# Altium schematic sheet SH5 - MICROCONTROLLER.SchDoc: MCU
size Letter; DrawnBy: Qinyang Bao, Nicole Rosario; Organization: UW Robotics; Address1: 200 University Avenue; Address2: Waterloo; Address3: Ontario; Address4: Canada N2L 3G6
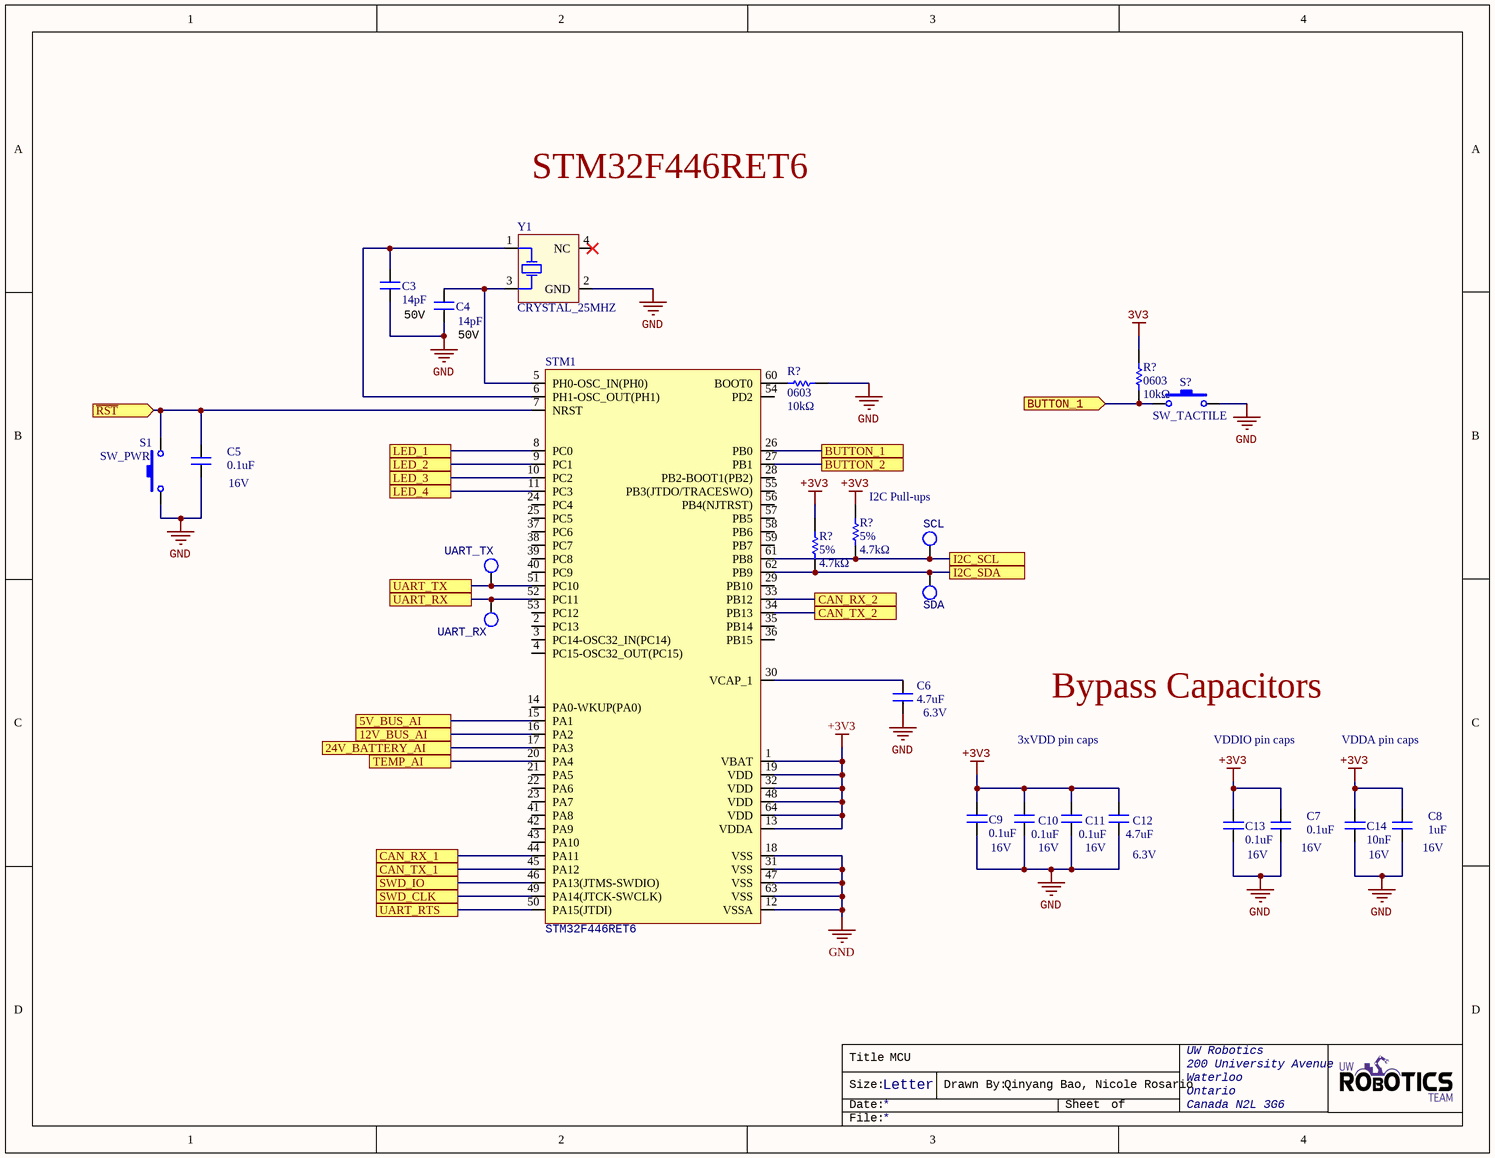
[diagram p0: SH5 - MICROCONTROLLER.SchDoc]

## Parts
(Parts that share a designator on the sheet are numbered #1, #2 ... from top to bottom, then left to right.)
C3  value 14pF  Voltage Rating: 50V  [CAPC0603(1608)55_N]  (hidden comment: CL10C140JB8NNNC)
C4  value 14pF  Voltage Rating: 50V  [CAPC0603(1608)55_N]  (hidden comment: CL10C140JB8NNNC)
C5  value 0.1uF  Voltage Rating: 16V  [CAPC0603(1608)55_N]  (hidden comment: CAP_0.1uF_16V_0603)
C6  value 4.7uF  Voltage Rating: 6.3V  [CAPC0603(1608)55_N]  (hidden comment: CAP_4.7uF_0603)
C7  value 0.1uF  Voltage Rating: 16V  [CAPC0603(1608)55_N]  (hidden comment: CAP_0.1uF_16V_0603)
C8  value 1uF  Voltage Rating: 16V  [CAPC0603(1608)55_N]  (hidden comment: CAP_1uF_16V_0603)
C9  value 0.1uF  Voltage Rating: 16V  [CAPC0603(1608)55_N]  (hidden comment: CAP_0.1uF_16V_0603)
C10  value 0.1uF  Voltage Rating: 16V  [CAPC0603(1608)55_N]  (hidden comment: CAP_0.1uF_16V_0603)
C11  value 0.1uF  Voltage Rating: 16V  [CAPC0603(1608)55_N]  (hidden comment: CAP_0.1uF_16V_0603)
C12  value 4.7uF  Voltage Rating: 6.3V  [CAPC0603(1608)55_N]  (hidden comment: CAP_4.7uF_0603)
C13  value 0.1uF  Voltage Rating: 16V  [CAPC0603(1608)55_N]  (hidden comment: CAP_0.1uF_16V_0603)
C14  value 10nF  Voltage Rating: 16V  [CAPC0603(1608)55_N]  (hidden comment: CAP_10nF_0603)
R?#1  value 10kΩ  Case Code (Imperial): 0603  [RESC0603(1608)_N]  (hidden comment: RES_10kΩ_0603)
R?#2  value 10kΩ  Case Code (Imperial): 0603  [RESC0603(1608)_N]  (hidden comment: RES_10kΩ_0603)
R?#3  value 4.7kΩ  Tolerance: 5%  [RESC0603(1608)_N]  (hidden comment: RES_4.7kΩ_0603)
R?#4  value 4.7kΩ  Tolerance: 5%  [RESC0603(1608)_N]  (hidden comment: RES_4.7kΩ_0603)
S1  SW_PWR  [PTS830GM140]
S?  SW_TACTILE  [B3U-1100P]
SCL  TESTPOINT_LOOP  [TESTPOINT_LOOP]  (value not drawn)
SDA  TESTPOINT_LOOP  [TESTPOINT_LOOP]  (value not drawn)
STM1  STM32F446RET6  [STM-LQFP64_L]
UART_RX  TESTPOINT_LOOP  [TESTPOINT_LOOP]  (value not drawn)
UART_TX  TESTPOINT_LOOP  [TESTPOINT_LOOP]  (value not drawn)
Y1  CRYSTAL_25MHZ  [AVX-CX2520DB32000D0GEJZ1-4_V]

## Ports
5V_BUS_AI, 12V_BUS_AI, 24V_BATTERY_AI, BUTTON_1, BUTTON_1 (in), BUTTON_2, CAN_RX_1, CAN_RX_2, CAN_TX_1, CAN_TX_2, I2C_SCL, I2C_SDA, LED_1, LED_2, LED_3, LED_4, SWD_CLK, SWD_IO, TEMP_AI, UART_RTS, UART_RX, UART_TX, ~{RST} (in)

## Nets
3V3: R?#1.2
+3V3: C7.2 C8.2 C9.2 C10.2 C11.2 C12.2 C13.2 C14.2 R?#3.2 R?#4.2 STM1.1(VBAT) STM1.13(VDDA) STM1.19(VDD) STM1.32(VDD) STM1.48(VDD) STM1.64(VDD)
GND: C3.1 C4.1 C5.1 C6.1 C7.1 C8.1 C9.1 C10.1 C11.1 C12.1 C13.1 C14.1 R?#2.2 S1.1 S?.2 STM1.12(VSSA) STM1.18(VSS) STM1.31(VSS) STM1.47(VSS) STM1.63(VSS) Y1.2(GND)
5V_BUS_AI: STM1.15(PA1) ; port 5V_BUS_AI
12V_BUS_AI: STM1.16(PA2) ; port 12V_BUS_AI
24V_BATTERY_AI: STM1.17(PA3) ; port 24V_BATTERY_AI
~{RST}: C5.2 S1.2 STM1.7(NRST) ; port ~{RST}
BUTTON_1: R?#1.1 S?.1 STM1.26(PB0) ; port BUTTON_1
BUTTON_2: STM1.27(PB1) ; port BUTTON_2
CAN_RX_1: STM1.44(PA11) ; port CAN_RX_1
CAN_RX_2: STM1.33(PB12) ; port CAN_RX_2
CAN_TX_1: STM1.45(PA12) ; port CAN_TX_1
CAN_TX_2: STM1.34(PB13) ; port CAN_TX_2
I2C_SCL: R?#3.1 SCL.1 STM1.61(PB8) ; port I2C_SCL
I2C_SDA: R?#4.1 SDA.1 STM1.62(PB9) ; port I2C_SDA
LED_1: STM1.8(PC0) ; port LED_1
LED_2: STM1.9(PC1) ; port LED_2
LED_3: STM1.10(PC2) ; port LED_3
LED_4: STM1.11(PC3) ; port LED_4
SWD_CLK: STM1.49(PA14(JTCK-SWCLK)) ; port SWD_CLK
SWD_IO: STM1.46(PA13(JTMS-SWDIO)) ; port SWD_IO
TEMP_AI: STM1.20(PA4) ; port TEMP_AI
UART_RTS: STM1.50(PA15(JTDI)) ; port UART_RTS
UART_RX: STM1.52(PC11) UART_RX.1 ; port UART_RX
UART_TX: STM1.51(PC10) UART_TX.1 ; port UART_TX
NetC3_2: C3.2 STM1.6(PH1-OSC_OUT(PH1)) Y1.1(HOT)
NetC4_2: C4.2 STM1.5(PH0-OSC_IN(PH0)) Y1.3(HOT)
NetC6_2: C6.2 STM1.30(VCAP_1)
NetR?#2_1: R?#2.1 STM1.60(BOOT0)

Not connected (* = marked no-connect by the designer): STM1 2(PC13) 3(PC14-OSC32_IN(PC14)) 4(PC15-OSC32_OUT(PC15)) 14(PA0-WKUP(PA0)) 21(PA5) 22(PA6) 23(PA7) 24(PC4) 25(PC5) 28(PB2-BOOT1(PB2)) 29(PB10) 35(PB14) 36(PB15) 37(PC6) 38(PC7) 39(PC8) 40(PC9) 41(PA8) 42(PA9) 43(PA10) 53(PC12) 54(PD2) 55(PB3(JTDO/TRACESWO)) 56(PB4(NJTRST)) 57(PB5) 58(PB6) 59(PB7); Y1 4(NC)*

## Notes on the sheet
- STM32F446RET6
- (near R?#3) I2C Pull-ups
- Bypass Capacitors
- 3xVDD pin caps
- VDDIO pin caps
- VDDA pin caps
- Title
- Size:
- Date:
- Letter
- Drawn By:
- Sheet
- of
- File:

## Library data of the parts
C3 C4 = CL10C140JB8NNNC: Cap Ceramic 14pF 50V C0G 5% SMD 0603 125C Cardboard T/R; Manufacturer 1: Samsung; Supplier Part Number 1: 1276-2187-1-ND; Supplier 1: Digi-Key; Manufacturer Part Number 1: CL10C140JB8NNNC; Stock 1: 187088; Pricing 1: 1=0.10000, 10=0.06700, 100=0.02980, 500=0.02130, 1000=0.01673 (USD); RoHS: Yes; Mount: Surface Mount; Case/Package: 0603; Case Code (Metric): 1608; Case Code (Imperial): 0603; Min Operating Temperature: -55°C; Max Operating Temperature: 125°C; Tolerance: 5%; Package Quantity: 1; Packaging: Tape and Reel; Voltage Rating (DC): 50V; Dielectric: C0G; Length: 1.6mm; Height: 0.8mm; Width: 0.031inch; Depth: 0.8mm; Thickness: 0.035inch; Radiation Hardening: No; ComponentLink1URL: https://datasheet.ciiva.com/25782/cl10c140jb8nnnc-25782947.pdf?src-supplier=Digi-Key; ComponentLink1Description: https://datasheet.ciiva.com/25782/cl10c140jb8nnnc-25782947.pdf?src-supplier=Digi-Key; Capacitance: 14pF
C5 C7 C9-C11 C13 = CAP_0.1uF_16V_0603: CAP CER 0.1UF 16V X7R 0603; Manufacturer: Yageo; MPN: CC0603KRX7R7BB104; Dimensions: 0.063" L x 0.031" W (1.60mm x 0.80mm); Package: 0603 (1608 Metric); Temperature Coefficient: X7R; Supplier Part Number 1: 311-1088-1-ND; Supplier 1: Digi-Key
C6 C12 = CAP_4.7uF_0603: CAP CER 4.7UF 6.3V X5R 0603; Manufacturer: Yageo; MPN: CC0603KRX5R5BB475; Dimensions: 0.063" L x 0.031" W (1.60mm x 0.80mm); Package: 0603 (1608 Metric); Temperature Coefficient: X5R; Supplier Part Number 1: 311-1521-1-ND; Supplier 1: Digi-Key
C8 = CAP_1uF_16V_0603: CAP CER 1UF 16V Y5V 0603; Manufacturer: Yageo; MPN: CC0603ZRY5V7BB105; Dimensions: 0.063" L x 0.031" W (1.60mm x 0.80mm); Package: 0603 (1608 Metric); Temperature Coefficient: Y5V; Supplier Part Number 1: 311-1372-1-ND; Supplier 1: Digi-Key
C14 = CAP_10nF_0603: CAP CER 10000PF 16V X7R 0603; Manufacturer: Yageo; MPN: CC0603KRX7R7BB103; Dimensions: 0.063" L x 0.031" W (1.60mm x 0.80mm); Package: 0603 (1608 Metric); Temperature Coefficient: X7R; Supplier Part Number 1: 311-3369-1-ND; Supplier 1: Digi-Key
R?#1 R?#2 = RES_10kΩ_0603: RES SMD 10K OHM 5% 1/10W 0603; Manufacturer 1: Yageo; Manufacturer Part Number 1: RC0603JR-0710KL; Package: 0603 (1608 Metric); Dimensions: 0.063" L x 0.031" W (1.60mm x 0.80mm); Supplier Part Number 1: 311-10KGRCT-ND; Supplier 1: Digi-Key; Mount: Surface Mount; Case Code (Metric): 1608; Tolerance: 5%
R?#3 R?#4 = RES_4.7kΩ_0603: RES SMD 4.7K OHM 5% 1/10W 0603; Manufacturer 1: Yageo; Manufacturer Part Number 1: RC0603JR-074K7L; Package: 0603 (1608 Metric); Dimensions: 0.063" L x 0.031" W (1.60mm x 0.80mm); Supplier Part Number 1: 311-4.7KGRCT-ND; Supplier 1: Digi-Key; Mount: Surface Mount; Case Code (Metric): 1608; Case Code (Imperial): 0603
S1 = SW_PWR: Power Switch (Red); pin to pad: 2>4; MPN: PTS830GM140 SMTR LFS; Manufacturer: C&K; ComponentLink1Description: Datasheet; ComponentLink1URL: https://www.ckswitches.com/media/1478/pts830.pdf; Supplier Part Number 1: CKN10587CT-ND; Supplier 1: Digi-Key
S? = SW_TACTILE: Tactile Switch (Grey); Manufacturer: Omron Electronics Inc-EMC Div; MPN: B3U-1100P; Supplier 1: Digi-Key
SCL SDA UART_RX UART_TX = TESTPOINT_LOOP: Loop testpoint through-hole pad; Manufacturer: Keystone Electronics; Manufacturer Part Number 1: 5002; Supplier Part Number 1: 36-5002-ND; Supplier 1: Digi-Key
STM1 = MCU_STM32F446RET6: ARM Cortex-M4 32-bit MCU+FPU, 512 KB Flash, 128 KB Internal RAM, 50 I/Os, 64-Pin LQFP, -40 to 85 degC, Tray; I/Os (High Current): 50; Supply Voltage(Vcc) min (V): 1.7; Operating Frequency(F) (Processor speed) (MHz): 180; D/A Converter: 2; Internal RAM Size (kB): 128; FLASH Size (Prog) (kB): 512; Core: ARM Cortex-M4; ComponentLink1Description: Manufacturer URL; Package Reference: 64-Pin Low-profile Quad Flat Package, Body 10 x 10 mm, Pitch 0.5 mm; ComponentLink2URL: http://www.st.com/st-web-ui/static/active/en/resource/technical/document/datasheet/DM00141306.pdf; Packing: Tray; DatasheetVersion: Rev. 6; ComponentLink1URL: http://www.st.com/; ComponentLink2Description: Datasheet; Package Description: LQFP64; Mounting Technology: Surface Mount; Supplier Part Number 1: 497-15376-ND; Supplier 1: Digi-Key
Y1 = CRYSTAL_25MHZ: CRYSTAL 25.0000MHZ 12PF SMD; Manufacturer 1: Kyocera AVX; Manufacturer Part Number 1: CX2520DB25000H0FLJC1; Frequency: 25MHz; ESR (Equivalent Series Resistance): 80R; Frequency Stability: 15ppm; Frequency Tolerance: 10ppm; ComponentLink1Description: https://media.digikey.com/pdf/Data%20Sheets/AVX%20PDFs/CX2520DB_USY1M-H1-16429-00_Spec.pdf?src-supplier=Digi-Key; ComponentLink1URL: https://media.digikey.com/pdf/Data%20Sheets/AVX%20PDFs/CX2520DB_USY1M-H1-16429-00_Spec.pdf?src-supplier=Digi-Key; Supplier 1: Digi-Key; Supplier Part Number 1: 1253-1724-1-ND; Stock 1: 11741; Pricing 1: 1=0.72000, 10=0.63300, 50=0.59120, 100=0.52250, 500=0.49500, 1000=0.41250 (USD); RoHS: Yes; Mount: Surface Mount; Case/Package: SMD/SMT; Min Operating Temperature: -30°C; Max Operating Temperature: 85°C; Packaging: Tape and Reel; Load Capacitance: 12pF; Length: 0.098inch; Height: 0.022inch; Width: 0.079inch; Ratings: AEC-Q200